# Altium schematic sheet Vsense 0-223.3V.SchDoc: Vsense from 0 to 223.3V
size Letter; Date: 2017-02-08; DocumentNumber: 13; Revision: A; SheetNumber: 13; SheetTotal: 16; DesignedBy: Mike MacKay
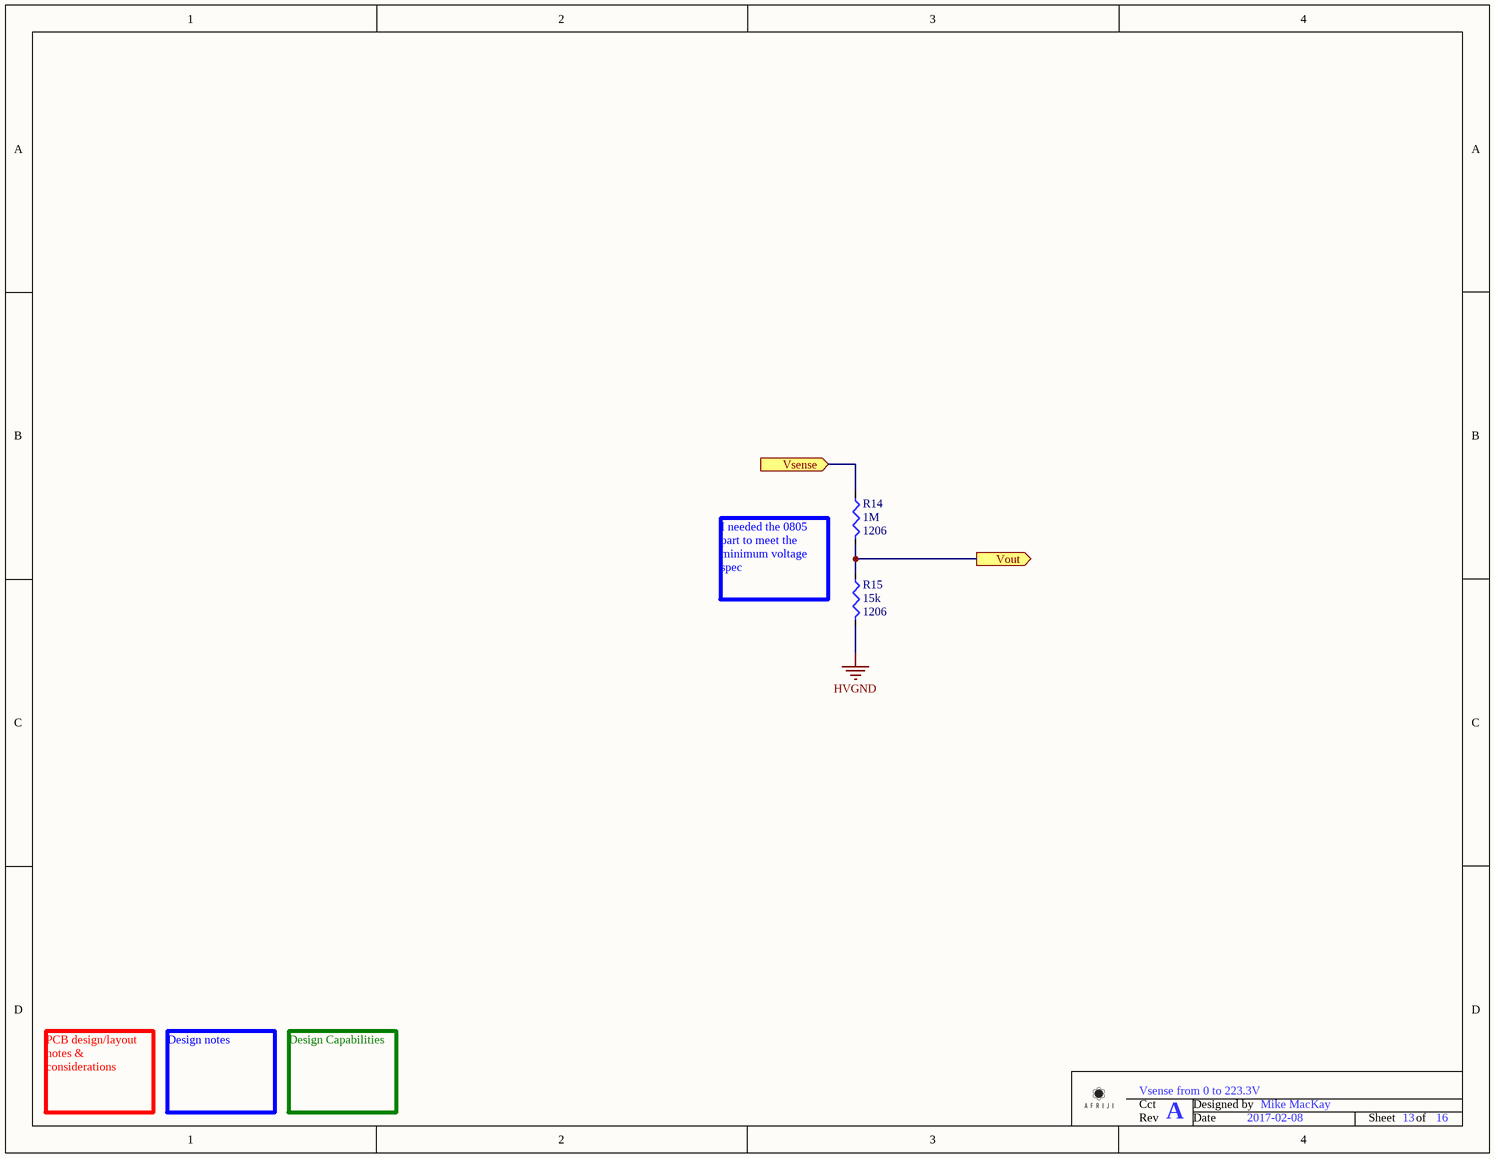
[diagram p0: Vsense 0-223.3V.SchDoc]

## Parts
R14  Resistance (Ohms): 1M  Supplier Device Package: 1206  [R1210]  (hidden comment: Template - Resistor)
R15  Resistance (Ohms): 15k  Supplier Device Package: 1206  [R1210]  (hidden comment: Template - Resistor)

## Ports
Vout (out), Vsense (in)

## Nets
HVGND: R15.1
Vout: R14.1 R15.2 ; port Vout
Vsense: R14.2 ; port Vsense

## Notes on the sheet
- I needed the 0805 part to meet the minimum voltage spec
- PCB design/layout notes & considerations
- Design notes
- Design Capabilities
- Cct
- Designed by
- Rev
- Date
- Sheet
- of

## Library data of the parts
R14 = Template - Resistor: Resistor; Manufacturer: Yageo; Manufacturer Part Number: RV1206FR-071ML; Value: 1M 1206 1%; Description: RES SMD 1M OHM 1% 1/4W 1206; Tolerance: ±1%; Power (Watts): 0.25W, 1/4W; Temperature Coefficient: ±200ppm/°C; Supplier 1: Digi-Key; Supplier Part Number 1: 311-1MNICT-ND; RoHS: RoHS Compliant; Category: Resistors; Stock 1: 79790; Pricing 1: 1=0.34, 10=0.289, 25=0.2104, 50=0.1526, 100=0.1131, 250=0.0868, 500=0.06838, 1000=0.04734 (USD); Packaging: Cut Tape (CT); Part Status: Active; Composition: Thick Film; Features: High Voltage, Moisture Resistant; Operating Temperature: -55°C ~ 155°C; Package / Case: 1206 (3216 Metric); Size / Dimension: 0.122" L x 0.063" W (3.10mm x 1.60mm); Height - Seated (Max): 0.026" (0.65mm); Number of Terminations: 2; Failure Rate: -; ComponentLink1URL: http://www.yageo.com/documents/recent/PYu-RV_51_RoHS_L_6.pdf; ComponentLink1Description: http://www.yageo.com/documents/recent/PYu-RV_51_RoHS_L_6.pdf
R15 = Template - Resistor: Manufacturer: Yageo; Manufacturer Part Number: RC1206FR-0715KL; Value: 15k 1206 1%; Description: RES SMD 15K OHM 1% 1/4W 1206; Tolerance: ±1%; Power (Watts): 0.25W, 1/4W; Temperature Coefficient: ±100ppm/°C; Supplier 1: Digi-Key; Supplier Part Number 1: 311-15.0KFRCT-ND; RoHS: RoHS Compliant; Category: Resistors; Stock 1: 143517; Pricing 1: 1=0.1, 10=0.029, 25=0.0212, 50=0.016, 100=0.0118, 250=0.009, 500=0.0072, 1000=0.0053 (USD); Packaging: Cut Tape (CT); Part Status: Active; Composition: Thick Film; Features: Moisture Resistant; Operating Temperature: -55°C ~ 155°C; Package / Case: 1206 (3216 Metric); Size / Dimension: 0.122" L x 0.063" W (3.10mm x 1.60mm); Height - Seated (Max): 0.026" (0.65mm); Number of Terminations: 2; Failure Rate: -; ComponentLink1URL: http://www.yageo.com/NewPortal/yageodocoutput?fileName=/pdf/R-Chip/PYu-RC_Group_51_RoHS_L_4.pdf; ComponentLink1Description: http://www.yageo.com/NewPortal/yageodocoutput?fileName=/pdf/R-Chip/PYu-RC_Group_51_RoHS_L_4.pdf